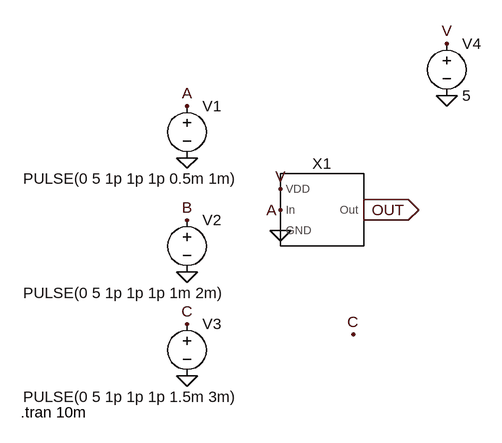
[diagram p0: schematic 3_AND test.asc]
3_AND test.asc, the LTspice schematic file:
Version 4
SHEET 1 880 680
FLAG 32 80 0
FLAG 32 0 A
FLAG 32 256 0
FLAG 32 176 B
FLAG 32 416 0
FLAG 32 336 C
FLAG 176 160 A
FLAG 288 352 C
FLAG 432 -16 0
FLAG 432 -96 V
FLAG 176 128 V
FLAG 176 192 0
FLAG 304 160 OUT
IOPIN 304 160 Out
SYMBOL voltage 32 -16 R0
WINDOW 3 -252 128 Left 2
WINDOW 123 0 0 Left 0
WINDOW 39 0 0 Left 0
SYMATTR Value PULSE(0 5 1p 1p 1p 0.5m 1m)
SYMATTR InstName V1
SYMBOL voltage 32 160 R0
WINDOW 3 -252 128 Left 2
WINDOW 123 0 0 Left 0
WINDOW 39 0 0 Left 0
SYMATTR Value PULSE(0 5 1p 1p 1p 1m 2m)
SYMATTR InstName V2
SYMBOL voltage 32 320 R0
WINDOW 3 -252 128 Left 2
WINDOW 123 0 0 Left 0
WINDOW 39 0 0 Left 0
SYMATTR Value PULSE(0 5 1p 1p 1p 1.5m 3m)
SYMATTR InstName V3
SYMBOL voltage 432 -112 R0
SYMATTR InstName V4
SYMATTR Value 5
SYMBOL NOT 240 160 R0
SYMATTR InstName X1
TEXT -224 472 Left 2 !.tran 10m

The netlist it stands for:
* 3_AND test.asc
V1 A 0 PULSE(0 5 1p 1p 1p 0.5m 1m)
V2 B 0 PULSE(0 5 1p 1p 1p 1m 2m)
V3 C 0 PULSE(0 5 1p 1p 1p 1.5m 3m)
V4 V 0 5
XX1 0 A V OUT NOT  ; pins GND In VDD Out
.tran 10m
.backanno
.end

* Results of the author's LTspice run, read from the files saved beside the schematic
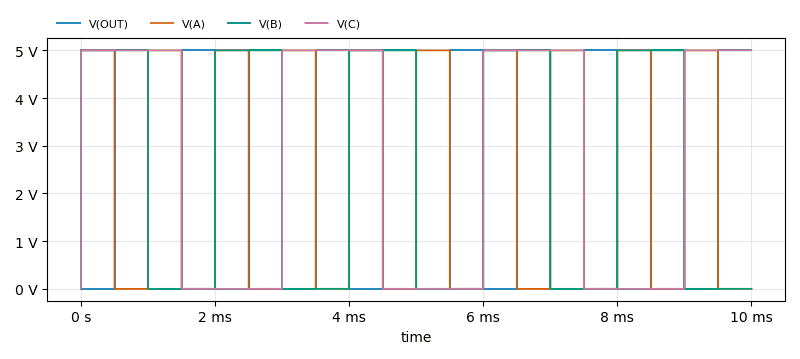
[diagram p1: Transient Analysis of 3_AND test.asc, plotted from the saved traces]
* Transient Analysis, 1 run:
*   V(OUT): min 0 V, max 5 V, average 2.5 V, rms 3.536 V, last 5 V
*   V(A): min 0 V, max 5 V, average 2.5 V, rms 3.536 V, last 0 V
*   V(B): min 0 V, max 5 V, average 2.5 V, rms 3.536 V, last 0 V
*   V(C): min 0 V, max 5 V, average 2.75 V, rms 3.708 V, last 5 V